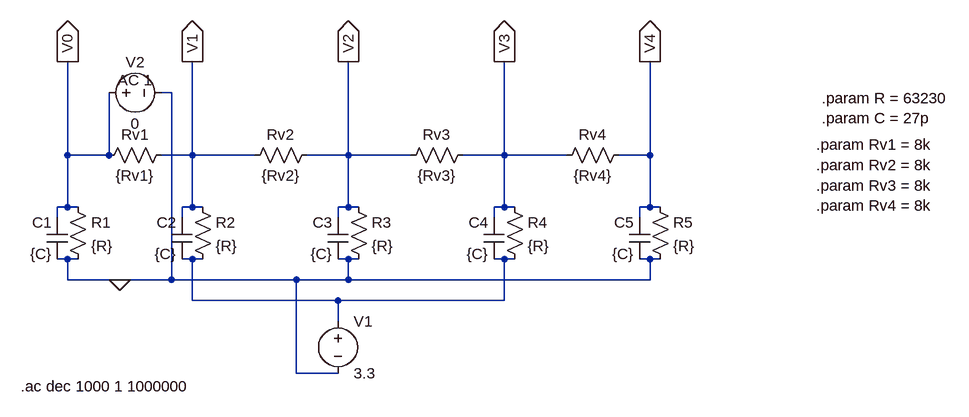
[diagram p0: schematic ACanalysisSensor.asc]
ACanalysisSensor.asc, the LTspice schematic file:
Version 4
SHEET 1 1368 680
WIRE 144 -64 128 -64
WIRE -16 32 -16 -112
WIRE 48 32 48 -64
WIRE 48 32 -16 32
WIRE 176 32 176 -112
WIRE 176 32 128 32
WIRE 272 32 176 32
WIRE 416 32 416 -112
WIRE 416 32 352 32
WIRE 512 32 416 32
WIRE 656 32 656 -112
WIRE 656 32 592 32
WIRE 752 32 656 32
WIRE 880 32 880 -112
WIRE 880 32 832 32
WIRE -16 112 -16 32
WIRE -16 112 -32 112
WIRE 0 112 -16 112
WIRE 176 112 176 32
WIRE 176 112 160 112
WIRE 192 112 176 112
WIRE 416 112 416 32
WIRE 416 112 400 112
WIRE 432 112 416 112
WIRE 656 112 656 32
WIRE 656 112 640 112
WIRE 672 112 656 112
WIRE 880 112 880 32
WIRE 880 112 864 112
WIRE 896 112 880 112
WIRE -32 128 -32 112
WIRE 160 128 160 112
WIRE 400 128 400 112
WIRE 640 128 640 112
WIRE 864 128 864 112
WIRE -16 192 -32 192
WIRE 0 192 -16 192
WIRE 176 192 160 192
WIRE 192 192 176 192
WIRE 416 192 400 192
WIRE 432 192 416 192
WIRE 656 192 640 192
WIRE 672 192 656 192
WIRE 880 192 864 192
WIRE 896 192 880 192
WIRE -16 224 -16 192
WIRE 64 224 -16 224
WIRE 144 224 144 -64
WIRE 144 224 64 224
WIRE 336 224 144 224
WIRE 416 224 416 192
WIRE 416 224 336 224
WIRE 880 224 880 192
WIRE 880 224 416 224
WIRE 176 256 176 192
WIRE 400 256 176 256
WIRE 656 256 656 192
WIRE 656 256 400 256
WIRE 400 288 400 256
WIRE 336 368 336 224
WIRE 400 368 336 368
FLAG 64 224 0
FLAG -16 -112 V0
IOPIN -16 -112 Out
FLAG 176 -112 V1
IOPIN 176 -112 Out
FLAG 416 -112 V2
IOPIN 416 -112 Out
FLAG 656 -112 V3
IOPIN 656 -112 Out
FLAG 880 -112 V4
IOPIN 880 -112 Out
SYMBOL res -16 96 R0
SYMATTR InstName R1
SYMATTR Value {R}
SYMBOL res 176 96 R0
SYMATTR InstName R2
SYMATTR Value {R}
SYMBOL res 416 96 R0
SYMATTR InstName R3
SYMATTR Value {R}
SYMBOL res 656 96 R0
SYMATTR InstName R4
SYMATTR Value {R}
SYMBOL res 880 96 R0
SYMATTR InstName R5
SYMATTR Value {R}
SYMBOL res 32 48 R270
WINDOW 0 32 56 VTop 2
WINDOW 3 0 56 VBottom 2
SYMATTR InstName Rv1
SYMATTR Value {Rv1}
SYMBOL res 256 48 R270
WINDOW 0 32 56 VTop 2
WINDOW 3 0 56 VBottom 2
SYMATTR InstName Rv2
SYMATTR Value {Rv2}
SYMBOL res 496 48 R270
WINDOW 0 32 56 VTop 2
WINDOW 3 0 56 VBottom 2
SYMATTR InstName Rv3
SYMATTR Value {Rv3}
SYMBOL res 736 48 R270
WINDOW 0 32 56 VTop 2
WINDOW 3 0 56 VBottom 2
SYMATTR InstName Rv4
SYMATTR Value {Rv4}
SYMBOL cap -16 128 M0
SYMATTR InstName C1
SYMATTR Value {C}
SYMBOL cap 176 128 M0
SYMATTR InstName C2
SYMATTR Value {C}
SYMBOL cap 416 128 M0
SYMATTR InstName C3
SYMATTR Value {C}
SYMBOL cap 656 128 M0
SYMATTR InstName C4
SYMATTR Value {C}
SYMBOL cap 880 128 M0
SYMATTR InstName C5
SYMATTR Value {C}
SYMBOL voltage 400 272 R0
WINDOW 123 0 0 Left 2
WINDOW 39 0 0 Left 2
SYMATTR InstName V1
SYMATTR Value 3.3
SYMBOL voltage 32 -64 R270
WINDOW 0 32 56 VTop 2
WINDOW 3 -32 56 VBottom 2
WINDOW 123 4 56 VTop 2
WINDOW 39 0 0 Left 2
SYMATTR InstName V2
SYMATTR Value 0
SYMATTR Value2 AC 1
TEXT 1144 -56 Left 2 !.param R = 63230\n.param C = 27p
TEXT 1136 16 Left 2 !.param Rv1 = 8k\n.param Rv2 = 8k\n.param Rv3 = 8k\n.param Rv4 = 8k
TEXT -88 388 Left 2 !.ac dec 1000 1 1000000

The netlist it stands for:
* ACanalysisSensor.asc
R1 V0 0 {R}
R2 V1 N001 {R}
R3 V2 0 {R}
R4 V3 N001 {R}
R5 V4 0 {R}
Rv1 V0 V1 {Rv1}
Rv2 V1 V2 {Rv2}
Rv3 V2 V3 {Rv3}
Rv4 V3 V4 {Rv4}
C1 V0 0 {C}
C2 V1 N001 {C}
C3 V2 0 {C}
C4 V3 N001 {C}
C5 V4 0 {C}
V1 N001 0 3.3
V2 V0 0 0 AC 1
.param R = 63230
.param C = 27p
.param Rv1 = 8k
.param Rv2 = 8k
.param Rv3 = 8k
.param Rv4 = 8k
.ac dec 1000 1 1000000
.backanno
.end